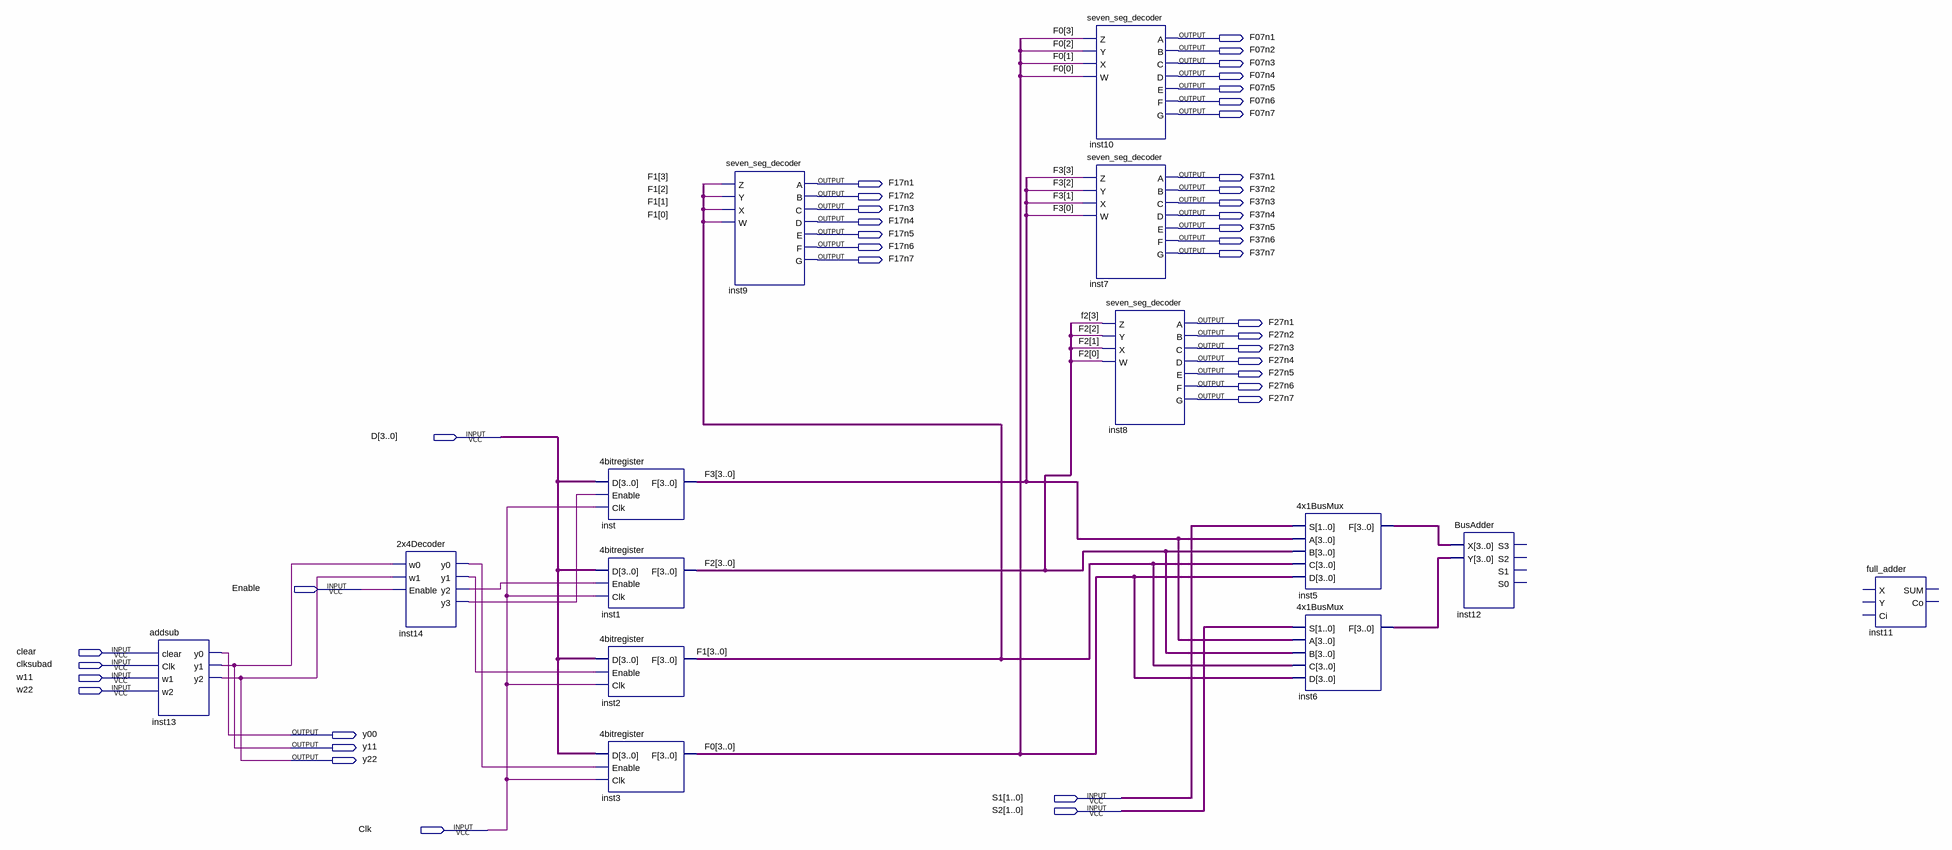
[diagram p0: schematic sheet]
// Quartus schematic RegisterFile.bdf as structural Verilog: 14 symbols, 40 pins
module RegisterFile (
  input  [3:0] D,
  input  Enable,
  input  clear,
  input  clksubad,
  input  w11,
  input  w22,
  input  [1:0] S1,
  input  [1:0] S2,
  input  Clk,
  output F07n1,
  output F07n2,
  output F07n3,
  output F07n4,
  output F07n5,
  output F07n6,
  output F07n7,
  output F37n1,
  output F17n1,
  output F37n2,
  output F17n2,
  output F37n3,
  output F17n3,
  output F37n4,
  output F17n4,
  output F37n5,
  output F17n5,
  output F37n6,
  output F17n6,
  output F37n7,
  output F17n7,
  output F27n1,
  output F27n2,
  output F27n3,
  output F27n4,
  output F27n5,
  output F27n6,
  output F27n7,
  output y00,
  output y11,
  output y22
);

  wire inst14_y0, inst14_y1, inst14_y2, inst14_y3;
  wire [3:0] F0, F1, F2, F3, inst5_f, inst6_f;

  addsub inst13 (.clear(clear), .Clk(clksubad), .w1(w11), .w2(w22), .y0(y00), .y1(y11), .y2(y22));
  \2x4Decoder  inst14 (
    .w0(y11), .w1(y22), .Enable(Enable), .y0(inst14_y0), .y1(inst14_y1), .y2(inst14_y2), .y3(inst14_y3));
  \4bitregister  inst (.D(D), .Enable(inst14_y3), .Clk(Clk), .F(F3));
  \4bitregister  inst1 (.D(D), .Enable(inst14_y2), .Clk(Clk), .F(F2));
  \4bitregister  inst2 (.D(D), .Enable(inst14_y1), .Clk(Clk), .F(F1));
  \4bitregister  inst3 (.D(D), .Enable(inst14_y0), .Clk(Clk), .F(F0));
  seven_seg_decoder inst9 (
    .Z(F1[3]), .Y(F1[2]), .X(F1[1]), .W(F1[0]), .A(F17n1), .B(F17n2), .C(F17n3), .D(F17n4), .E(F17n5),
    .F(F17n6), .G(F17n7));
  seven_seg_decoder inst10 (
    .Z(F0[3]), .Y(F0[2]), .X(F0[1]), .W(F0[0]), .A(F07n1), .B(F07n2), .C(F07n3), .D(F07n4), .E(F07n5),
    .F(F07n6), .G(F07n7));
  seven_seg_decoder inst7 (
    .Z(F3[3]), .Y(F3[2]), .X(F3[1]), .W(F3[0]), .A(F37n1), .B(F37n2), .C(F37n3), .D(F37n4), .E(F37n5),
    .F(F37n6), .G(F37n7));
  seven_seg_decoder inst8 (
    .Z(F2[3]), .Y(F2[2]), .X(F2[1]), .W(F2[0]), .A(F27n1), .B(F27n2), .C(F27n3), .D(F27n4), .E(F27n5),
    .F(F27n6), .G(F27n7));
  \4x1BusMux  inst5 (.S(S1), .A(F3), .B(F2), .C(F1), .D(F0), .F(inst5_f));
  \4x1BusMux  inst6 (.S(S2), .A(F3), .B(F2), .C(F1), .D(F0), .F(inst6_f));
  BusAdder inst12 (.X(inst5_f), .Y(inst6_f));  // open: S3, S2, S1, S0
  full_adder inst11 ();  // open: X, Y, Ci, SUM, Co
endmodule
